# Altium schematic sheet FT232.SchDoc
size A4
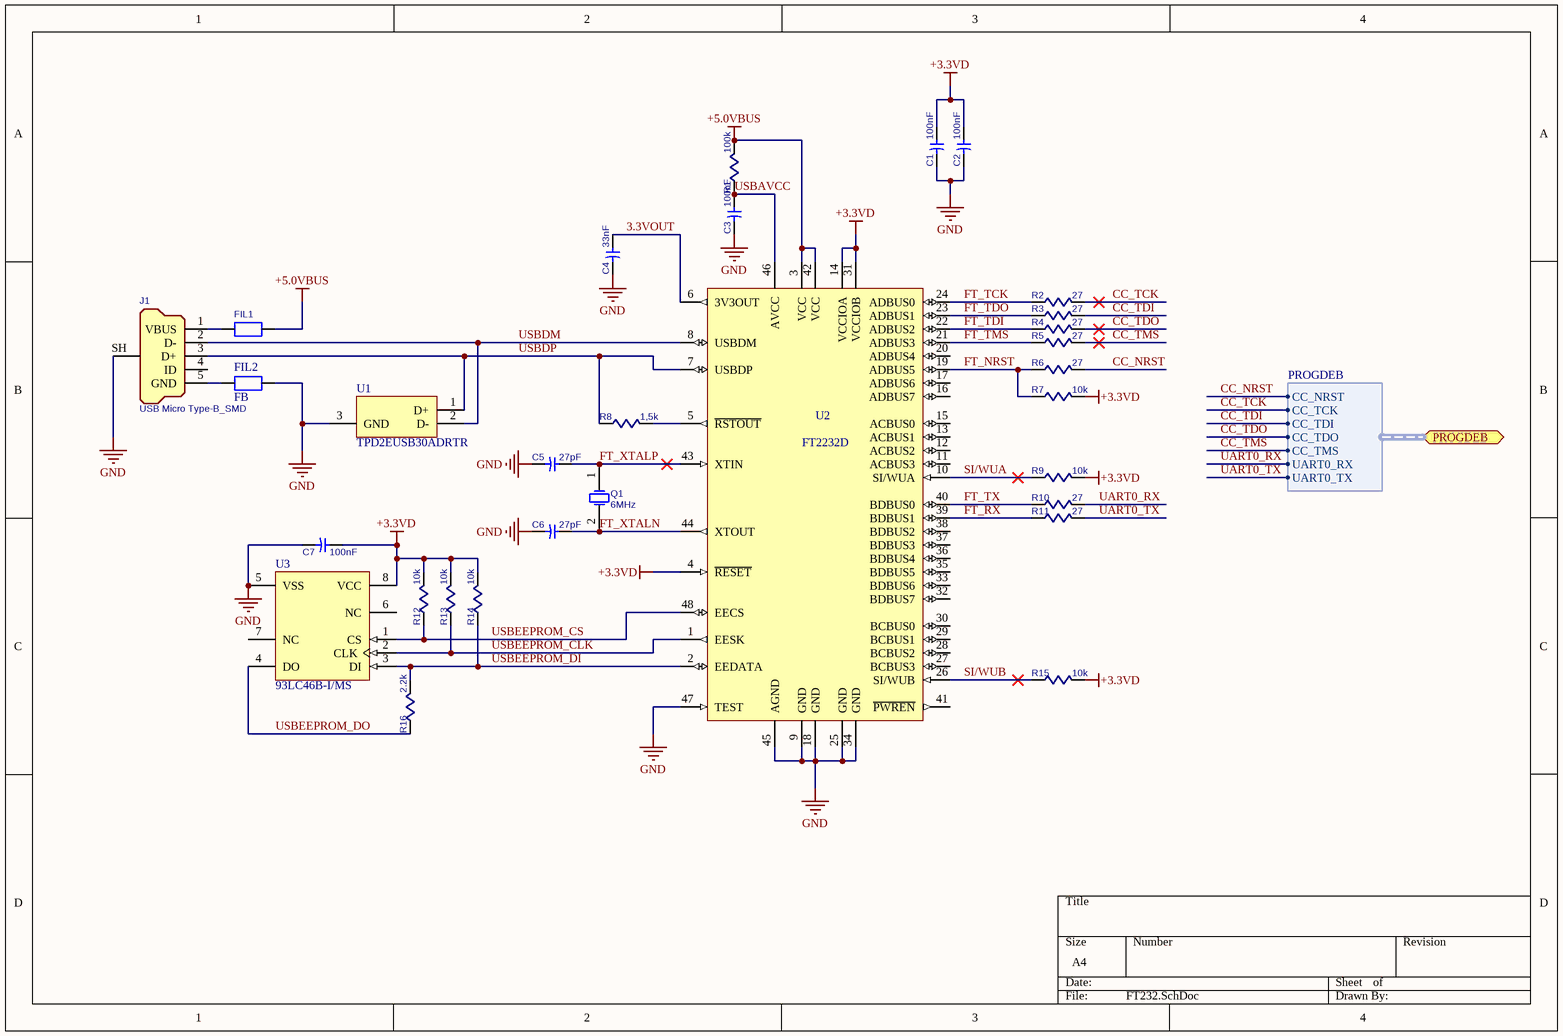
[diagram p0: FT232.SchDoc]

## Parts
C1  100nF  [C_0603A]
C2  100nF  [C_0603A]
C3  100nF  [C_0603A]
C4  33nF  [C_0603A]
C5  27pF  [C_0603A]
C6  27pF  [C_0603A]
C7  100nF  [C_0603A]
FIL1  FB  [FB_0603]  (value not drawn)
FIL2  FB  [FB_0603]
J1  USB Micro Type-B_SMD  [MICRO USB TYPE-B_SMD]
Q1  6MHz  [QUARTZ_10x4.5]
R1  100k  [R_0603]
R2  27  [R_0603]
R3  27  [R_0603]
R4  27  [R_0603]
R5  27  [R_0603]
R6  27  [R_0603]
R7  10k  [R_0603]
R8  1,5k  [R_0603]
R9  10k  [R_0603]
R10  27  [R_0603]
R11  27  [R_0603]
R12  10k  [R_0603]
R13  10k  [R_0603]
R14  10k  [R_0603]
R15  10k  [R_0603]
R16  2.2k  [R_0603]
U1  TPD2EUSB30ADRTR  [DRT0003A]
U2  FT2232D  [LQFP-48_N]
U3  93LC46B-I/MS  [MSOP-MS8_N]

## Ports
PROGDEB (harness PROGDEB)

## Harnesses
PROGDEB: CC_NRST, CC_TCK, CC_TDI, CC_TDO, CC_TMS, UART0_RX, UART0_TX

## Nets
+3.3VD: C1.1 C2.1 C7.1 R7.1 R9.1 R12.1 R13.1 R14.1 R15.1 U2.4(~{RESET}) U2.14(VCCIOA) U2.31(VCCIOB) U3.8(VCC)
+5.0VBUS: FIL1.1 R1.1 U2.3(VCC) U2.42(VCC)
GND: C1.2 C2.2 C3.2 C4.2 C5.2 C6.2 C7.2 FIL2.1 J1.SH(Shell) U1.3(GND) U2.9(GND) U2.18(GND) U2.25(GND) U2.34(GND) U2.45(AGND) U2.47(TEST) U3.5(VSS)
3.3VOUT: C4.1 U2.6(3V3OUT)
CC_NRST: R6.1 ; port PROGDEB.CC_NRST
CC_TCK: R2.1 ; port PROGDEB.CC_TCK
CC_TDI: R3.1 ; port PROGDEB.CC_TDI
CC_TDO: R4.1 ; port PROGDEB.CC_TDO
CC_TMS: R5.1 ; port PROGDEB.CC_TMS
FT_NRST: R6.2 R7.2 U2.19(ADBUS5)
FT_RX: R11.2 U2.39(BDBUS1)
FT_TCK: R2.2 U2.24(ADBUS0)
FT_TDI: R4.2 U2.22(ADBUS2)
FT_TDO: R3.2 U2.23(ADBUS1)
FT_TMS: R5.2 U2.21(ADBUS3)
FT_TX: R10.2 U2.40(BDBUS0)
FT_XTALN: C6.1 Q1.2(X2) U2.44(XTOUT)
FT_XTALP: C5.1 Q1.1(X1) U2.43(XTIN)
SI/WUA: R9.2 U2.10(SI/WUA)
SI/WUB: R15.2 U2.26(SI/WUB)
UART0_RX: R10.1 ; port PROGDEB.UART0_RX
UART0_TX: R11.1 ; port PROGDEB.UART0_TX
USBAVCC: C3.1 R1.2 U2.46(AVCC)
USBDM: J1.2(D-) U1.2(D-) U2.8(USBDM)
USBDP: J1.3(D+) R8.2 U1.1(D+) U2.7(USBDP)
USBEEPROM_CLK: R13.2 U2.1(EESK) U3.2(CLK)
USBEEPROM_CS: R12.2 U2.48(EECS) U3.1(CS)
USBEEPROM_DI: R14.2 R16.1 U2.2(EEDATA) U3.3(DI)
USBEEPROM_DO: R16.2 U3.4(DO)
NetFIL1_2: FIL1.2 J1.1(VBUS)
NetFIL2_2: FIL2.2 J1.5(GND)
NetR8_1: R8.1 U2.5(~{RSTOUT})

Not connected (* = marked no-connect by the designer): J1 4(ID); U2 11(ACBUS3) 12(ACBUS2) 13(ACBUS1) 15(ACBUS0) 16(ADBUS7) 17(ADBUS6) 20(ADBUS4) 27(BCBUS3) 28(BCBUS2) 29(BCBUS1) 30(BCBUS0) 32(BDBUS7) 33(BDBUS6) 35(BDBUS5) 36(BDBUS4) 37(BDBUS3) 38(BDBUS2) 41(~{PWREN}); U3 6(NC) 7(NC)

## Library data of the parts
C1-C7 = C_0603: PackageReference: C_0603
  C1-C3 C7: VALUE: 100nF
  C4: VALUE: 33nF
  C5 C6: VALUE: 27pF
FIL1 FIL2 = FB_0603: Manufacturer Part Number: MPZ1608S221ATA00; Manufacturer: TDK Corporation; Current Rating: 2.2A; Impedance: 220 Ohm; DC Resistance (DCR) (Max): 50 mOhm; Filter Type: Power Line; Number of Lines: 1; Impedance @ Frequency: 220 Ohm @ 100MHz; Ratings: -; Package / Case: 0603 (1608 Metric); Part Status: Active; Current Rating (Max): 2.2A; Packaging: Cut Tape (CT); Operating Temperature: -55°C ~ 125°C; Mounting Type: Surface Mount; Height (Max): 0.037" (0.95mm); Size / Dimension: 0.063" L x 0.031" W (1.60mm x 0.80mm); RoHS: RoHS Compliant; Supplier 1: Digi-Key; Category: Filters; ComponentLink1URL: https://product.tdk.com/info/en/catalog/datasheets/beads_commercial_power_mpz1608_en.pdf; ComponentLink1Description: https://product.tdk.com/info/en/catalog/datasheets/beads_commercial_power_mpz1608_en.pdf; Supplier Part Number 1: 445-1565-1-ND
J1 = USB Micro Type-B_SMD: USB Micro Type-B; Manufacturer: Amphenol FCI; Manufacturer Part Number: 10118192-0001LF; Gender: Receptacle; Number of Contacts: 5; Connector Type: USB - micro B; Specifications: USB 2.0; Supplier 1: Digi-Key; URL: http://www.te.com/commerce/DocumentDelivery/DDEController?Action=srchrtrv&DocNm=2174507&DocType=Customer+Drawing&DocLang=JP; Category: Connectors, Interconnects; Packaging: Cut Tape (CT); Part Status: Active; RoHS: RoHS Compliant; Mounting Type: Surface Mount, Right Angle, Horizontal; Ingress Protection: -; Features: Flange, Shielded; ComponentLink1URL: http://portal.fciconnect.com/Comergent//fci/drawing/10118192.pdf; ComponentLink1Description: http://portal.fciconnect.com/Comergent//fci/drawing/10118192.pdf; Supplier Part Number 1: 609-4613-1-ND
Q1 = QUARTZ_10x4.5mm: Manufacturer Part Number: FQ1045A-6.000; Manufacturer: Fox Electronics; Frequency Tolerance + / -: 20; Product Range: FC-135 Series; Frequency Nom: 32.768; Load Capacitance: 20pF; Crystal Case: SMD, 3.2mm x 1.5; Type: MHz Crystal; Frequency Stability: ±30ppm; ESR (Equivalent Series Resistance): 150 Ohm; Operating Mode: Fundamental; Supplier 1: Digi-Key; Frequency Stability + / -: -; Operating Temperature Max: 85; Packaging: Cut Tape (CT); RoHS: RoHS Compliant; Operating Temperature Min: -40; Supplier Part Number 1: 631-1035-1-ND; ComponentLink1Description: http://www.farnell.com/datasheets/1678503.pdf; ComponentLink1URL: http://www.farnell.com/datasheets/1678503.pdf; Category: Crystals and Oscillators; Part Status: Active; Frequency: 6MHz; Frequency Tolerance: ±30ppm; Operating Temperature: 0°C ~ 70°C; Ratings: -; Mounting Type: Surface Mount; Package / Case: 2-SMD; Size / Dimension: 0.394" L x 0.177" W (10.00mm x 4.50mm); Height: 0.067" (1.70mm); ComponentLink2URL: http://foxonline.com/pdfs/fq1045a.pdf; ComponentLink2Description: http://foxonline.com/pdfs/fq1045a.pdf
R1-R16 = R_0603: PackageReference: R_0603
  R1: VALUE: 100k
  R2-R6 R10 R11: VALUE: 27
  R7 R9 R12-R15: VALUE: 10k
  R8: VALUE: 1,5k
  R16: VALUE: 2.2k
U1 = CMP-0326-00047-3: ESD / Surge Solution for High Speed, Low Voltage Interface, 2 Channels, -40 to +85 degC, 3-pin SOT (DRT), Green (RoHS & no Sb/Br); Manufacturer: Texas Instruments; IEC 61000-4-2 Air-Gap(+/- kV): 8; SubFamily: ESD Solution; 1394 / Firewire: TRUE; IO Leakage Current(nA): 10; Differential Capacitance(pF): 0.05; Breakdown Voltage(Min)(V): 4.5; IO Capacitance(Typ)(pF): 0.7; Mounting Technology: Surface Mount; PartNumber: TPD2EUSB30ADRTR; ComponentLink2URL: SamplesURL:http://www.ti.com/product/tpd2eusb30a#samples; IEC 61000-4-2 Contact(+/- kV): 8; PackageReference: DRT0003A; Eco-Plan: Green (RoHS & no Sb/Br); ComponentLink2Description: URL Link1; USB Full Speed: TRUE; USB High Speed: TRUE; PackageDescription: 3-Flat Lead Plastic Small Outline, 1 x 1 mm (inc leads), 0.35 mm Pitch; Serial ATA / eSATA: TRUE; ComponentLink1URL: http://www.ti.com/general/docs/lit/getliterature.tsp?genericPartNumber=TPD2EUSB30A&fileType=pdf; DatasheetVersion: SLVSAC2C; PackageVersion: revD, Jun-2008; ComponentLink1Description: Datasheet; HDMI: TRUE; USB Super Speed: TRUE
U2 = CMP-0078-00017-3: FT2232D Dual USB to Serial UART/FIFO IC, -40 to +85 degC, 48-pin LQFP; Manufacturer: FTDI; ComponentLink1URL: http://www.ftdichip.com/; PackageDescription: 48-Pin Thin Quad Flat Pack, 7 x 7 mm Body, 0.5 mm Pitch; PackageVersion: Apr-11; ComponentLink2URL: http://www.ftdichip.com/Support/Documents/DataSheets/ICs/DS_FT2232D.pdf; PartNumber: FT2232D; ComponentLink2Description: Datasheet; DatasheetVersion: ver 2.05, Apr-2011; ComponentLink1Description: Manufacturer URL; PackageReference: LQFP-48
U3 = CMP-0162-00461-1: 1K, 64x16-bit, 2.5V Microwire Serial EEPROM, 8-Pin MSOP, Industrial Temperature; PackageReference: MSOP-MS8; PackageDescription: 8-Lead Plastic Micro Small Outline Package (MS) [MSOP]; PackageVersion: revBB, Aug-2009; DatasheetVersion: revG, May-2008